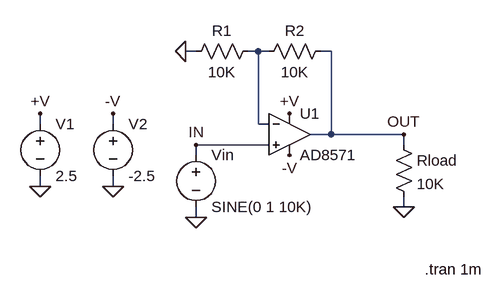
[diagram p0: schematic AD8571.asc]
AD8571.asc, the LTspice schematic file:
Version 4
SHEET 1 1240 700
WIRE 352 -1216 336 -1216
WIRE 448 -1216 432 -1216
WIRE 464 -1216 448 -1216
WIRE 560 -1216 544 -1216
WIRE 112 -1104 112 -1120
WIRE 224 -1104 224 -1120
WIRE 448 -1104 448 -1216
WIRE 464 -1104 448 -1104
WIRE 560 -1088 560 -1216
WIRE 560 -1088 528 -1088
WIRE 672 -1088 560 -1088
WIRE 464 -1072 352 -1072
WIRE 672 -1072 672 -1088
WIRE 352 -1056 352 -1072
WIRE 112 -1008 112 -1024
WIRE 224 -1008 224 -1024
WIRE 672 -976 672 -992
WIRE 352 -960 352 -976
FLAG 112 -1120 +V
FLAG 112 -1008 0
FLAG 352 -960 0
FLAG 672 -1088 OUT
FLAG 352 -1072 IN
FLAG 496 -1120 +V
FLAG 224 -1120 -V
FLAG 496 -1056 -V
FLAG 336 -1216 0
FLAG 672 -976 0
FLAG 224 -1008 0
SYMBOL Opamps\\AD8571 496 -1152 R0
SYMATTR InstName U1
SYMBOL voltage 112 -1120 R0
WINDOW 123 0 0 Left 2
WINDOW 39 0 0 Left 2
SYMATTR InstName V1
SYMATTR Value 2.5
SYMBOL voltage 352 -1072 R0
WINDOW 123 24 146 Left 2
WINDOW 39 24 125 Left 2
SYMATTR InstName Vin
SYMATTR Value SINE(0 1 10K)
SYMBOL res 448 -1232 R90
WINDOW 0 0 56 VBottom 2
WINDOW 3 32 56 VTop 2
SYMATTR InstName R1
SYMATTR Value 10K
SYMBOL res 560 -1232 R90
WINDOW 0 0 56 VBottom 2
WINDOW 3 32 56 VTop 2
SYMATTR InstName R2
SYMATTR Value 10K
SYMBOL voltage 224 -1120 R0
WINDOW 123 24 146 Left 2
WINDOW 39 24 125 Left 2
SYMATTR InstName V2
SYMATTR Value -2.5
SYMBOL res 656 -1088 R0
SYMATTR InstName Rload
SYMATTR Value 10K
TEXT 704 -880 Left 2 !.tran 1m

The netlist it stands for:
* AD8571.asc
XU1 IN N001 +V -V OUT AD8571  ; pins In+ In- V+ V- OUT
V1 +V 0 2.5
Vin IN 0 SINE(0 1 10K)
R1 N001 0 10K
R2 OUT N001 10K
V2 -V 0 -2.5
Rload OUT 0 10K
.tran 1m
.backanno
.end